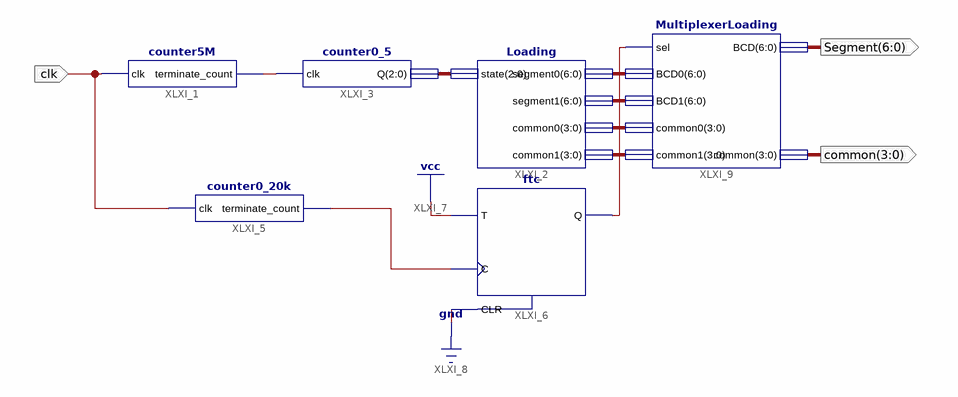
[diagram p0: schematic sheet 1]
// Xilinx ISE schematic top.sch (spartan6) as structural Verilog: 6 symbols, 3 ports
module top (
  input  clk,
  output [6:0] Segment,
  output [3:0] common
);

  wire XLXN_1, XLXN_7, XLXN_14;
  wire [2:0] XLXN_2;
  wire [3:0] XLXN_12, XLXN_13;
  wire [6:0] XLXN_10, XLXN_11;

  counter5M XLXI_1 (.clk(clk), .terminate_count(XLXN_1));
  Loading XLXI_2 (.state(XLXN_2), .segment0(XLXN_10), .segment1(XLXN_11), .common0(XLXN_12), .common1(XLXN_13));
  counter0_5 XLXI_3 (.clk(XLXN_1), .Q(XLXN_2));
  counter0_20k XLXI_5 (.clk(clk), .terminate_count(XLXN_7));
  ftc XLXI_6 (.C(XLXN_7), .CLR(1'b0), .T(1'b1), .Q(XLXN_14));
  MultiplexerLoading XLXI_9 (
    .sel(XLXN_14), .BCD0(XLXN_10), .BCD1(XLXN_11), .common0(XLXN_12), .common1(XLXN_13), .BCD(Segment),
    .common(common));
endmodule
